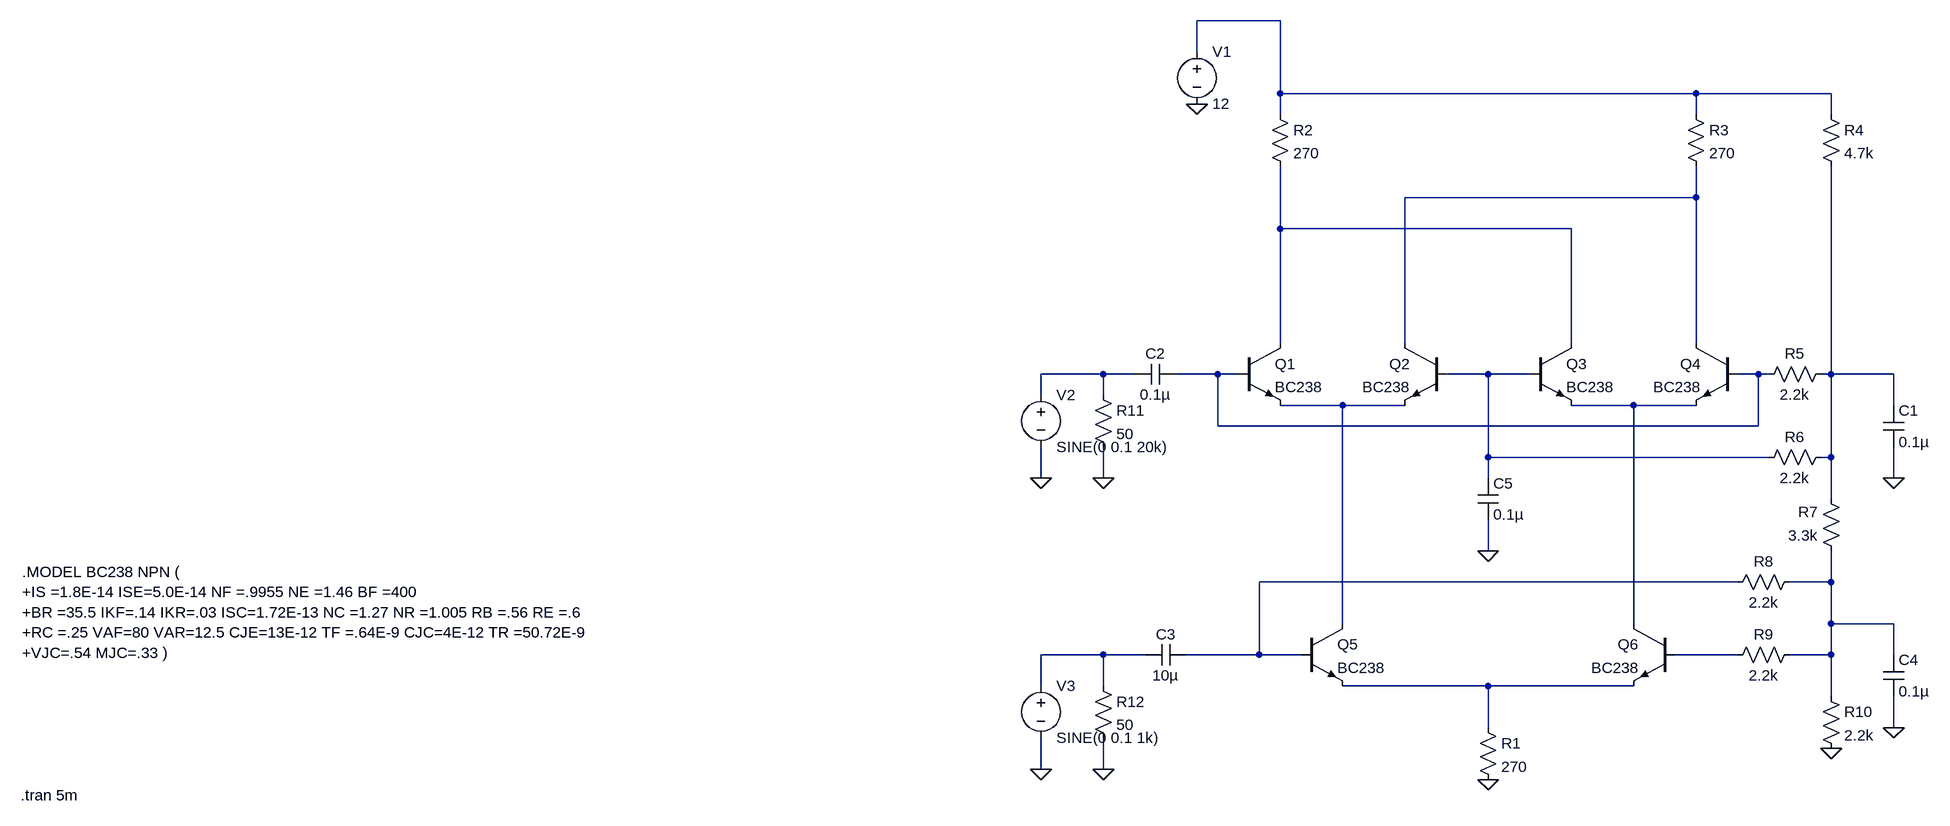
[diagram p0: schematic PROJECT.asc]
PROJECT.asc, the LTspice schematic file:
Version 4
SHEET 1 2852 696
WIRE 1632 -512 1504 -512
WIRE 1504 -464 1504 -512
WIRE 1632 -400 1632 -512
WIRE 2272 -400 1632 -400
WIRE 2480 -400 2272 -400
WIRE 1632 -368 1632 -400
WIRE 2272 -368 2272 -400
WIRE 2480 -368 2480 -400
WIRE 2272 -240 2272 -288
WIRE 2272 -240 1824 -240
WIRE 1632 -192 1632 -288
WIRE 2080 -192 1632 -192
WIRE 1632 -16 1632 -192
WIRE 1824 -16 1824 -240
WIRE 2080 -16 2080 -192
WIRE 2272 -16 2272 -240
WIRE 1360 32 1264 32
WIRE 1408 32 1360 32
WIRE 1536 32 1472 32
WIRE 1568 32 1536 32
WIRE 1952 32 1888 32
WIRE 2016 32 1952 32
WIRE 2368 32 2336 32
WIRE 2384 32 2368 32
WIRE 2480 32 2480 -288
WIRE 2480 32 2464 32
WIRE 2576 32 2480 32
WIRE 1264 64 1264 32
WIRE 1360 64 1360 32
WIRE 1728 80 1632 80
WIRE 1824 80 1728 80
WIRE 2176 80 2080 80
WIRE 2272 80 2176 80
WIRE 2576 80 2576 32
WIRE 1536 112 1536 32
WIRE 2368 112 2368 32
WIRE 2368 112 1536 112
WIRE 1952 160 1952 32
WIRE 2384 160 1952 160
WIRE 2480 160 2480 32
WIRE 2480 160 2464 160
WIRE 1264 192 1264 144
WIRE 1360 192 1360 144
WIRE 1952 192 1952 160
WIRE 2576 192 2576 144
WIRE 2480 224 2480 160
WIRE 1952 304 1952 256
WIRE 2336 352 1600 352
WIRE 2480 352 2480 304
WIRE 2480 352 2416 352
WIRE 1728 416 1728 80
WIRE 2176 416 2176 80
WIRE 2480 416 2480 352
WIRE 2576 416 2480 416
WIRE 1360 464 1264 464
WIRE 1424 464 1360 464
WIRE 1600 464 1600 352
WIRE 1600 464 1488 464
WIRE 1664 464 1600 464
WIRE 2336 464 2240 464
WIRE 2480 464 2480 416
WIRE 2480 464 2416 464
WIRE 2576 464 2576 416
WIRE 1264 512 1264 464
WIRE 1360 512 1360 464
WIRE 1952 512 1728 512
WIRE 2176 512 1952 512
WIRE 2480 528 2480 464
WIRE 1952 576 1952 512
WIRE 2576 576 2576 528
WIRE 1264 640 1264 592
WIRE 1360 640 1360 592
FLAG 1952 656 0
FLAG 2480 608 0
FLAG 1504 -384 0
FLAG 1360 192 0
FLAG 1264 192 0
FLAG 1264 640 0
FLAG 1360 640 0
FLAG 2576 192 0
FLAG 2576 576 0
FLAG 1952 304 0
SYMBOL npn 1568 -16 R0
SYMATTR InstName Q1
SYMATTR Value BC238
SYMBOL npn 1888 -16 M0
SYMATTR InstName Q2
SYMATTR Value BC238
SYMBOL npn 2016 -16 R0
SYMATTR InstName Q3
SYMATTR Value BC238
SYMBOL npn 2336 -16 M0
SYMATTR InstName Q4
SYMATTR Value BC238
SYMBOL npn 1664 416 R0
SYMATTR InstName Q5
SYMATTR Value BC238
SYMBOL npn 2240 416 M0
SYMATTR InstName Q6
SYMATTR Value BC238
SYMBOL res 1936 560 R0
SYMATTR InstName R1
SYMATTR Value 270
SYMBOL res 1616 -384 R0
SYMATTR InstName R2
SYMATTR Value 270
SYMBOL res 2256 -384 R0
SYMATTR InstName R3
SYMATTR Value 270
SYMBOL res 2464 -384 R0
SYMATTR InstName R4
SYMATTR Value 4.7k
SYMBOL res 2480 16 R90
WINDOW 0 0 56 VBottom 2
WINDOW 3 32 56 VTop 2
SYMATTR InstName R5
SYMATTR Value 2.2k
SYMBOL res 2480 144 R90
WINDOW 0 0 56 VBottom 2
WINDOW 3 32 56 VTop 2
SYMATTR InstName R6
SYMATTR Value 2.2k
SYMBOL res 2496 320 R180
WINDOW 0 36 76 Left 2
WINDOW 3 36 40 Left 2
SYMATTR InstName R7
SYMATTR Value 3.3k
SYMBOL res 2432 336 R90
WINDOW 0 0 56 VBottom 2
WINDOW 3 32 56 VTop 2
SYMATTR InstName R8
SYMATTR Value 2.2k
SYMBOL res 2432 448 R90
WINDOW 0 0 56 VBottom 2
WINDOW 3 32 56 VTop 2
SYMATTR InstName R9
SYMATTR Value 2.2k
SYMBOL res 2464 512 R0
SYMATTR InstName R10
SYMATTR Value 2.2k
SYMBOL res 1344 48 R0
SYMATTR InstName R11
SYMATTR Value 50
SYMBOL res 1344 496 R0
SYMATTR InstName R12
SYMATTR Value 50
SYMBOL cap 1472 16 R90
WINDOW 0 0 32 VBottom 2
WINDOW 3 32 32 VTop 2
SYMATTR InstName C2
SYMATTR Value 0.1µ
SYMBOL cap 1488 448 R90
WINDOW 0 0 32 VBottom 2
WINDOW 3 32 32 VTop 2
SYMATTR InstName C3
SYMATTR Value 10µ
SYMBOL voltage 1504 -480 R0
WINDOW 123 0 0 Left 0
WINDOW 39 0 0 Left 0
SYMATTR InstName V1
SYMATTR Value 12
SYMBOL voltage 1264 48 R0
WINDOW 123 0 0 Left 0
WINDOW 39 0 0 Left 0
SYMATTR InstName V2
SYMATTR Value SINE(0 0.1 20k)
SYMBOL voltage 1264 496 R0
WINDOW 123 0 0 Left 0
WINDOW 39 0 0 Left 0
SYMATTR InstName V3
SYMATTR Value SINE(0 0.1 1k)
SYMBOL cap 2560 80 R0
SYMATTR InstName C1
SYMATTR Value 0.1µ
SYMBOL cap 2560 464 R0
SYMATTR InstName C4
SYMATTR Value 0.1µ
SYMBOL cap 1936 192 R0
SYMATTR InstName C5
SYMATTR Value 0.1µ
TEXT -304 336 Left 2 !.MODEL BC238 NPN (\n+IS =1.8E-14 ISE=5.0E-14 NF =.9955 NE =1.46 BF =400\n+BR =35.5 IKF=.14 IKR=.03 ISC=1.72E-13 NC =1.27 NR =1.005 RB =.56 RE =.6\n+RC =.25 VAF=80 VAR=12.5 CJE=13E-12 TF =.64E-9 CJC=4E-12 TR =50.72E-9\n+VJC=.54 MJC=.33 )
TEXT -306 680 Left 2 !.tran 5m

The netlist it stands for:
* PROJECT.asc
Q1 N003 N005 N008 0 BC238
Q2 N002 N006 N008 0 BC238
Q3 N003 N006 N009 0 BC238
Q4 N002 N005 N009 0 BC238
Q5 N008 N010 N014 0 BC238
Q6 N009 N013 N014 0 BC238
R1 N014 0 270
R2 N001 N003 270
R3 N001 N002 270
R4 N001 N007 4.7k
R5 N007 N005 2.2k
R6 N007 N006 2.2k
R7 N011 N007 3.3k
R8 N011 N010 2.2k
R9 N011 N013 2.2k
R10 N011 0 2.2k
R11 N004 0 50
R12 N012 0 50
C2 N005 N004 0.1µ
C3 N010 N012 10µ
V1 N001 0 12
V2 N004 0 SINE(0 0.1 20k)
V3 N012 0 SINE(0 0.1 1k)
C1 N007 0 0.1µ
C4 N011 0 0.1µ
C5 N006 0 0.1µ
.model NPN NPN
.model PNP PNP
.lib standard.bjt
.MODEL BC238 NPN (
+IS =1.8E-14 ISE=5.0E-14 NF =.9955 NE =1.46 BF =400
+BR =35.5 IKF=.14 IKR=.03 ISC=1.72E-13 NC =1.27 NR =1.005 RB =.56 RE =.6
+RC =.25 VAF=80 VAR=12.5 CJE=13E-12 TF =.64E-9 CJC=4E-12 TR =50.72E-9
+VJC=.54 MJC=.33 )
.tran 5m
.backanno
.end